# Altium schematic sheet MAIN-BOARD.SchDoc
size A3
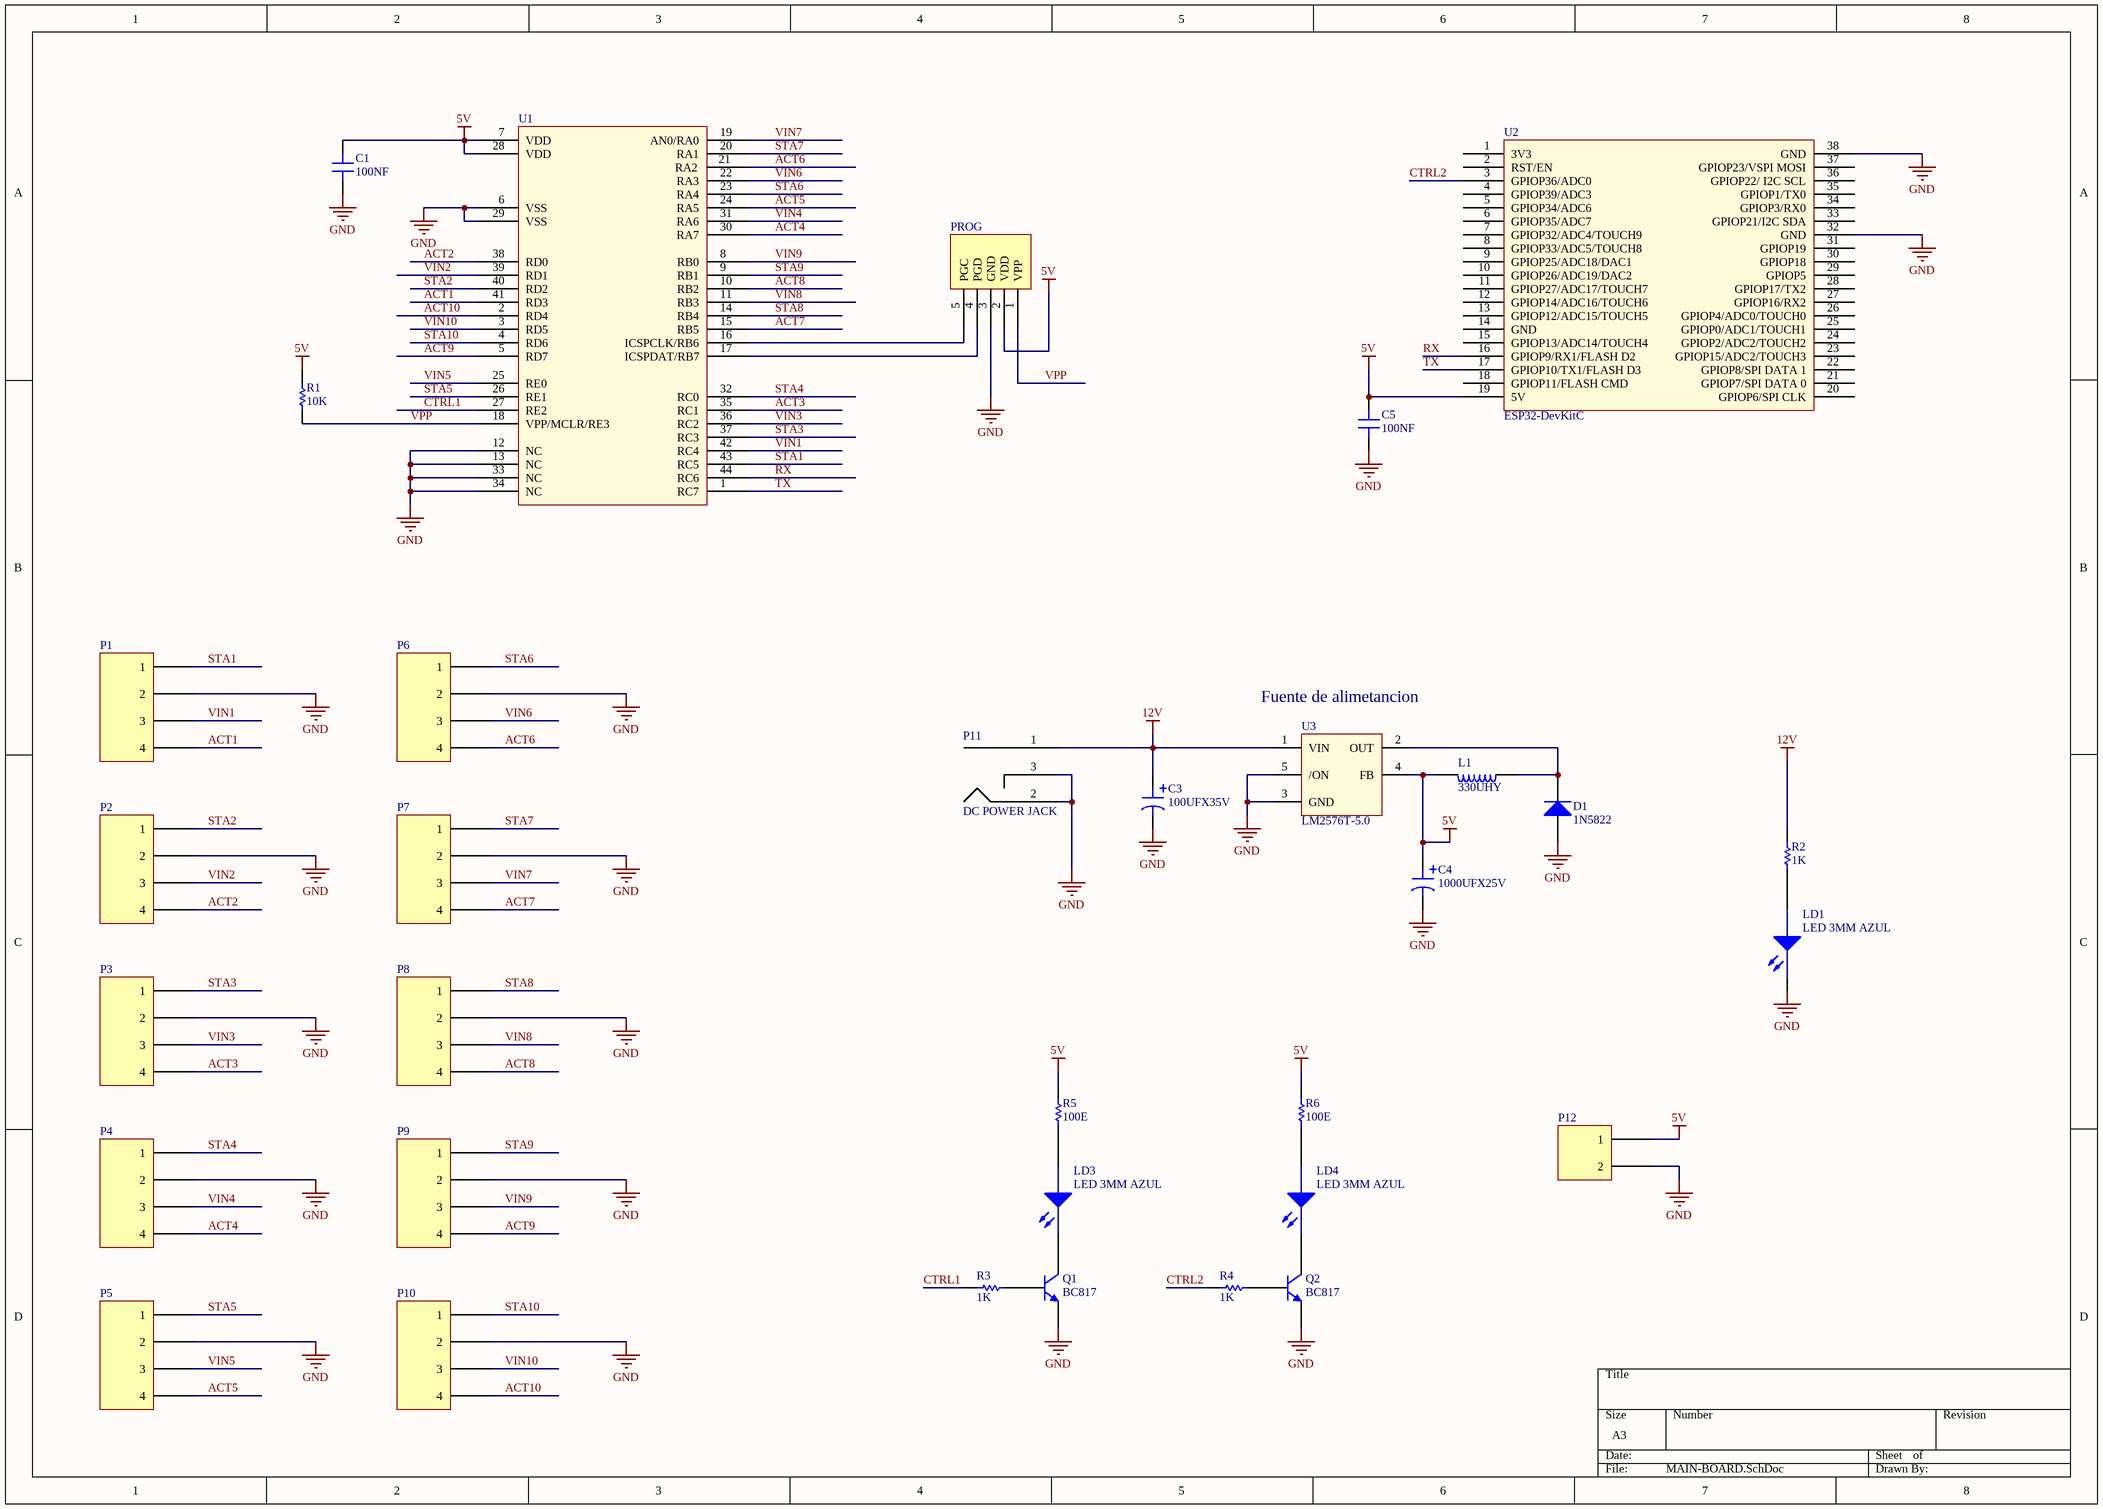
[diagram p0: MAIN-BOARD.SchDoc]

## Parts
C1  100NF  [CAP.SMD.0805]
C3  100UFX35V  [CAP-ELEC-8X11]
C4  1000UFX25V  [CAP-ELEC-12.5X20]
C5  100NF  [CAP.SMD.0805]
D1  1N5822  [Diode 1N5822]
L1  330UHY  [Inductor Radial DR1213]
LD1  LED 3MM AZUL  [LED 3MM AZUL]
LD3  LED 3MM AZUL  [LED 3MM AZUL]
LD4  LED 3MM AZUL  [LED 3MM AZUL]
P1  CONECTOR PWXXS MA-04 VERTICAL P=3.96MM PW0  [CONECTOR PWXXS MA-04 VERTICAL P=3.96MM]  (value not drawn)
P2  CONECTOR PWXXS MA-04 VERTICAL P=3.96MM PW0  [CONECTOR PWXXS MA-04 VERTICAL P=3.96MM]  (value not drawn)
P3  CONECTOR PWXXS MA-04 VERTICAL P=3.96MM PW0  [CONECTOR PWXXS MA-04 VERTICAL P=3.96MM]  (value not drawn)
P4  CONECTOR PWXXS MA-04 VERTICAL P=3.96MM PW0  [CONECTOR PWXXS MA-04 VERTICAL P=3.96MM]  (value not drawn)
P5  CONECTOR PWXXS MA-04 VERTICAL P=3.96MM PW0  [CONECTOR PWXXS MA-04 VERTICAL P=3.96MM]  (value not drawn)
P6  CONECTOR PWXXS MA-04 VERTICAL P=3.96MM PW0  [CONECTOR PWXXS MA-04 VERTICAL P=3.96MM]  (value not drawn)
P7  CONECTOR PWXXS MA-04 VERTICAL P=3.96MM PW0  [CONECTOR PWXXS MA-04 VERTICAL P=3.96MM]  (value not drawn)
P8  CONECTOR PWXXS MA-04 VERTICAL P=3.96MM PW0  [CONECTOR PWXXS MA-04 VERTICAL P=3.96MM]  (value not drawn)
P9  CONECTOR PWXXS MA-04 VERTICAL P=3.96MM PW0  [CONECTOR PWXXS MA-04 VERTICAL P=3.96MM]  (value not drawn)
P10  CONECTOR PWXXS MA-04 VERTICAL P=3.96MM PW0  [CONECTOR PWXXS MA-04 VERTICAL P=3.96MM]  (value not drawn)
P11  DC POWER JACK  [VAR-DC-JACK]
P12  BORNE 2P P=5MM 1.5MM2 15A AZUL XY301V-2P  [CON-BOR-X2-5MM]  (value not drawn)
PROG  In-Serial Circuit Programmer Header  [PIC ICSP]  (value not drawn)
Q1  BC817  [NPN.SMD.SOT23]
Q2  BC817  [NPN.SMD.SOT23]
R1  10K  [RES.SMD.103]
R2  1K  [RES.SMD.102]
R3  1K  [RES.SMD.102]
R4  1K  [RES.SMD.102]
R5  100E  [RES.SMD.101]
R6  100E  [RES.SMD.101]
U1  PIC16F18875-I/PT 44 TQFP 14KB Flash, 1KB RAM, 256B EE, 10b ADC2  [44TQFP - PIC16F18875]  (value not drawn)
U2  ESP32-DevKitC  [ESP32-DevKitC]
U3  LM2576T-5.0  [LM2576T-5.0]

## Nets
5V: C1.2 C4.1 C5.2 L1.1 P12.1 PROG.2(VDD) R1.2 R5.2 R6.2 U1.7(VDD) U1.28(VDD) U2.19(5V) U3.4(FB)
12V: C3.1 P11.1 R2.2 U3.1(VIN)
GND: C1.1 C3.2 C4.2 C5.1 D1.A LD1.K(KB) P1.2 P2.2 P3.2 P4.2 P5.2 P6.2 P7.2 P8.2 P9.2 P10.2 P11.2 P11.3 P12.2 PROG.3(GND) Q1.2(E) Q2.2(E) U1.6(VSS) U1.12(NC) U1.13(NC) U1.29(VSS) U1.33(NC) U1.34(NC) U2.32(GND) U2.38(GND) U3.3(GND) U3.5(/ON)
ACT1: P1.4 U1.41(RD3)
ACT2: P2.4 U1.38(RD0)
ACT3: P3.4 U1.35(RC1)
ACT4: P4.4 U1.30(RA7)
ACT5: P5.4 U1.24(RA5)
ACT6: P6.4 U1.21(RA2)
ACT7: P7.4 U1.15(RB5)
ACT8: P8.4 U1.10(RB2)
ACT9: P9.4 U1.5(RD7)
ACT10: P10.4 U1.2(RD4)
CTRL1: R3.2 U1.27(RE2)
CTRL2: R4.2 U2.3(GPIOP36/ADC0)
RX: U1.44(RC6) U2.16(GPIOP9/RX1/FLASH_D2)
STA1: P1.1 U1.43(RC5)
STA2: P2.1 U1.40(RD2)
STA3: P3.1 U1.37(RC3)
STA4: P4.1 U1.32(RC0)
STA5: P5.1 U1.26(RE1)
STA6: P6.1 U1.23(RA4)
STA7: P7.1 U1.20(RA1)
STA8: P8.1 U1.14(RB4)
STA9: P9.1 U1.9(RB1)
STA10: P10.1 U1.4(RD6)
TX: U1.1(RC7) U2.17(GPIOP10/TX1/FLASH_D3)
VIN1: P1.3 U1.42(RC4)
VIN2: P2.3 U1.39(RD1)
VIN3: P3.3 U1.36(RC2)
VIN4: P4.3 U1.31(RA6)
VIN5: P5.3 U1.25(RE0)
VIN6: P6.3 U1.22(RA3)
VIN7: P7.3 U1.19(AN0/RA0)
VIN8: P8.3 U1.11(RB3)
VIN9: P9.3 U1.8(RB0)
VIN10: P10.3 U1.3(RD5)
VPP: PROG.1(VPP) R1.1 U1.18(VPP/MCLR/RE3)
NetD1_K: D1.K L1.2 U3.2(OUT)
NetLD1_A: LD1.A(AB) R2.1
NetLD3_A: LD3.A(AB) R5.1
NetLD3_K: LD3.K(KB) Q1.3(C)
NetLD4_A: LD4.A(AB) R6.1
NetLD4_K: LD4.K(KB) Q2.3(C)
NetPROG_4: PROG.4(PGD) U1.17(ICSPDAT/RB7)
NetPROG_5: PROG.5(PGC) U1.16(ICSPCLK/RB6)
NetQ1_1: Q1.1(B) R3.1
NetQ2_1: Q2.1(B) R4.1

Not connected (* = marked no-connect by the designer): U2 1(3V3) 2(RST/EN) 4(GPIOP39/ADC3) 5(GPIOP34/ADC6) 6(GPIOP35/ADC7) 7(GPIOP32/ADC4/TOUCH9) 8(GPIOP33/ADC5/TOUCH8) 9(GPIOP25/ADC18/DAC1) 10(GPIOP26/ADC19/DAC2) 11(GPIOP27/ADC17/TOUCH7) 12(GPIOP14/ADC16/TOUCH6) 13(GPIOP12/ADC15/TOUCH5) 14(GND) 15(GPIOP13/ADC14/TOUCH4) 18(GPIOP11/FLASH_CMD) 20(GPIOP6/SPI_CLK) 21(GPIOP7/SPI_DATA_0) 22(GPIOP8/SPI_DATA_1) 23(GPIOP15/ADC2/TOUCH3) 24(GPIOP2/ADC2/TOUCH2) 25(GPIOP0/ADC1/TOUCH1) 26(GPIOP4/ADC0/TOUCH0) 27(GPIOP16/RX2) 28(GPIOP17/TX2) 29(GPIOP5) 30(GPIOP18) 31(GPIOP19) 33(GPIOP21/I2C_SDA) 34(GPIOP3/RX0) 35(GPIOP1/TX0) 36(GPIOP22/_I2C_SCL) 37(GPIOP23/VSPI_MOSI)

## Notes on the sheet
- (near U3) Fuente de alimetancion

## Library data of the parts
C1 C5 = Capacitor 100NFX50V X7R 10% CER.MULT. SMD 0805: 100NFX50V X7R 10% CER.MULT. SMD 0805; COD. ELEMON: CA3279774
C3 = Capacitor Electrolitico 100UFX35V 85°C 8x11 ELE.RAD AISHI: 100UFX35V 85°C 8x11 ELE.RAD AISHI; COD. ELEMON: CA3609372; COD. FV: CE.CAP.0009
C4 = Capacitor Electrolitico 1000UFX25V 85°C 12.5X20 ELE.RAD AISHI: 1000UFX25V 85°C 12.5X20 ELE.RAD AISHI; COD. ELEMON: CA3609291; COD. FV: CE.CAP.0010
D1 = Diodo Schottky 1N5822 3A 40V: COD. FV: CE.DIO.0002
L1 = Inductor Radial 330UHY 0.3R 1.4A RAD. 15.5X15.5MM: 330UHY 0.3R 1.4A RAD. 15.5X15.5MM; COD. ELEMON: FI1537220; COD. FV: CE.IND.0002
LD1 LD3 LD4 = LED 3MM AZUL WC SUPER BRILLO 1250mcd 30Âº 204-10SUBC/C470/S400-A6 PATAS 14MM: COD. ELEMON: OP1452620
P1-P10 = CONECTOR PWXXS MA-04 VERTICAL P=3.96MM PW04S: COD. ELEMON: CO5052040; COD. FV: CE.CON.0013
P11 = DC POWER JACK 90 GRA. 2MM: COD. ELEMON: MC6691355
P12 = BORNE 2P P=5MM 1.5MM2 15A AZUL XY301V-2P: COD. ELEMON: BO5812000
PROG = In-Serial Circuit Programmer Header: COD. ELEMON: CO4900906; COD. FV: CE.CON.0017
Q1 Q2 = Transistor BC817-40 TRA.NPN 45V0.5A 0.25W SOT23: BC817-40 TRA.NPN 45V0.5A 0.25W SOT23; COD. ELEMON: TR1723020; COD. FV: CE.TRA.0002
R1 = Resistencia 10K 5% 0805 1/8W: 10K 5% 0805 1/8W RES.SMD; COD. ELEMON: RS3896245
R2-R4 = Resistencia 1K 5% 0805 1/8W: 1K 5% 0805 1/8W RES.SMD; COD. ELEMON: RS3896185; COD. FV: CE.RES.0012
R5 R6 = Resistencia 100E 5% 0805 1/8W: 100E 5% 0805 1/8W RES.SMD; COD. ELEMON: RS3896125; COD. FV: CE.RES.0011
U1 = PIC16F18875-I/PT 44 TQFP 14KB Flash, 1KB RAM, 256B EE, 10b ADC2: COD. FV: CE.MIC.0002; COD. ELEMON: MI2986749
U3 = LM2576T-5.0 TO220 3A.STEP.DOWN.VOLT.REG.: COD. ELEMON: CI2707258H; COD. FV: CE.SEM.0002